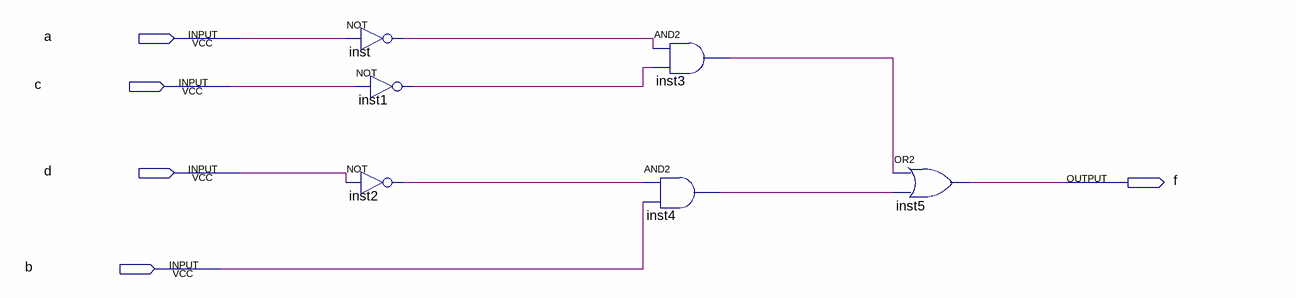
[diagram p0: schematic sheet]
// Quartus schematic Lab1schematicpart2.bdf as structural Verilog: 6 symbols, 5 pins
module Lab1schematicpart2 (
  input  a,
  input  c,
  input  d,
  input  b,
  output f
);

  wire inst1_out, inst2_out, inst3_out, inst4_out, inst_out;

  not inst (inst_out, a);
  not inst1 (inst1_out, c);
  not inst2 (inst2_out, d);
  and inst3 (inst3_out, inst_out, inst1_out);
  and inst4 (inst4_out, inst2_out, b);
  or inst5 (f, inst3_out, inst4_out);
endmodule
